# EAGLE design Knob (EAGLE 7.3.0)
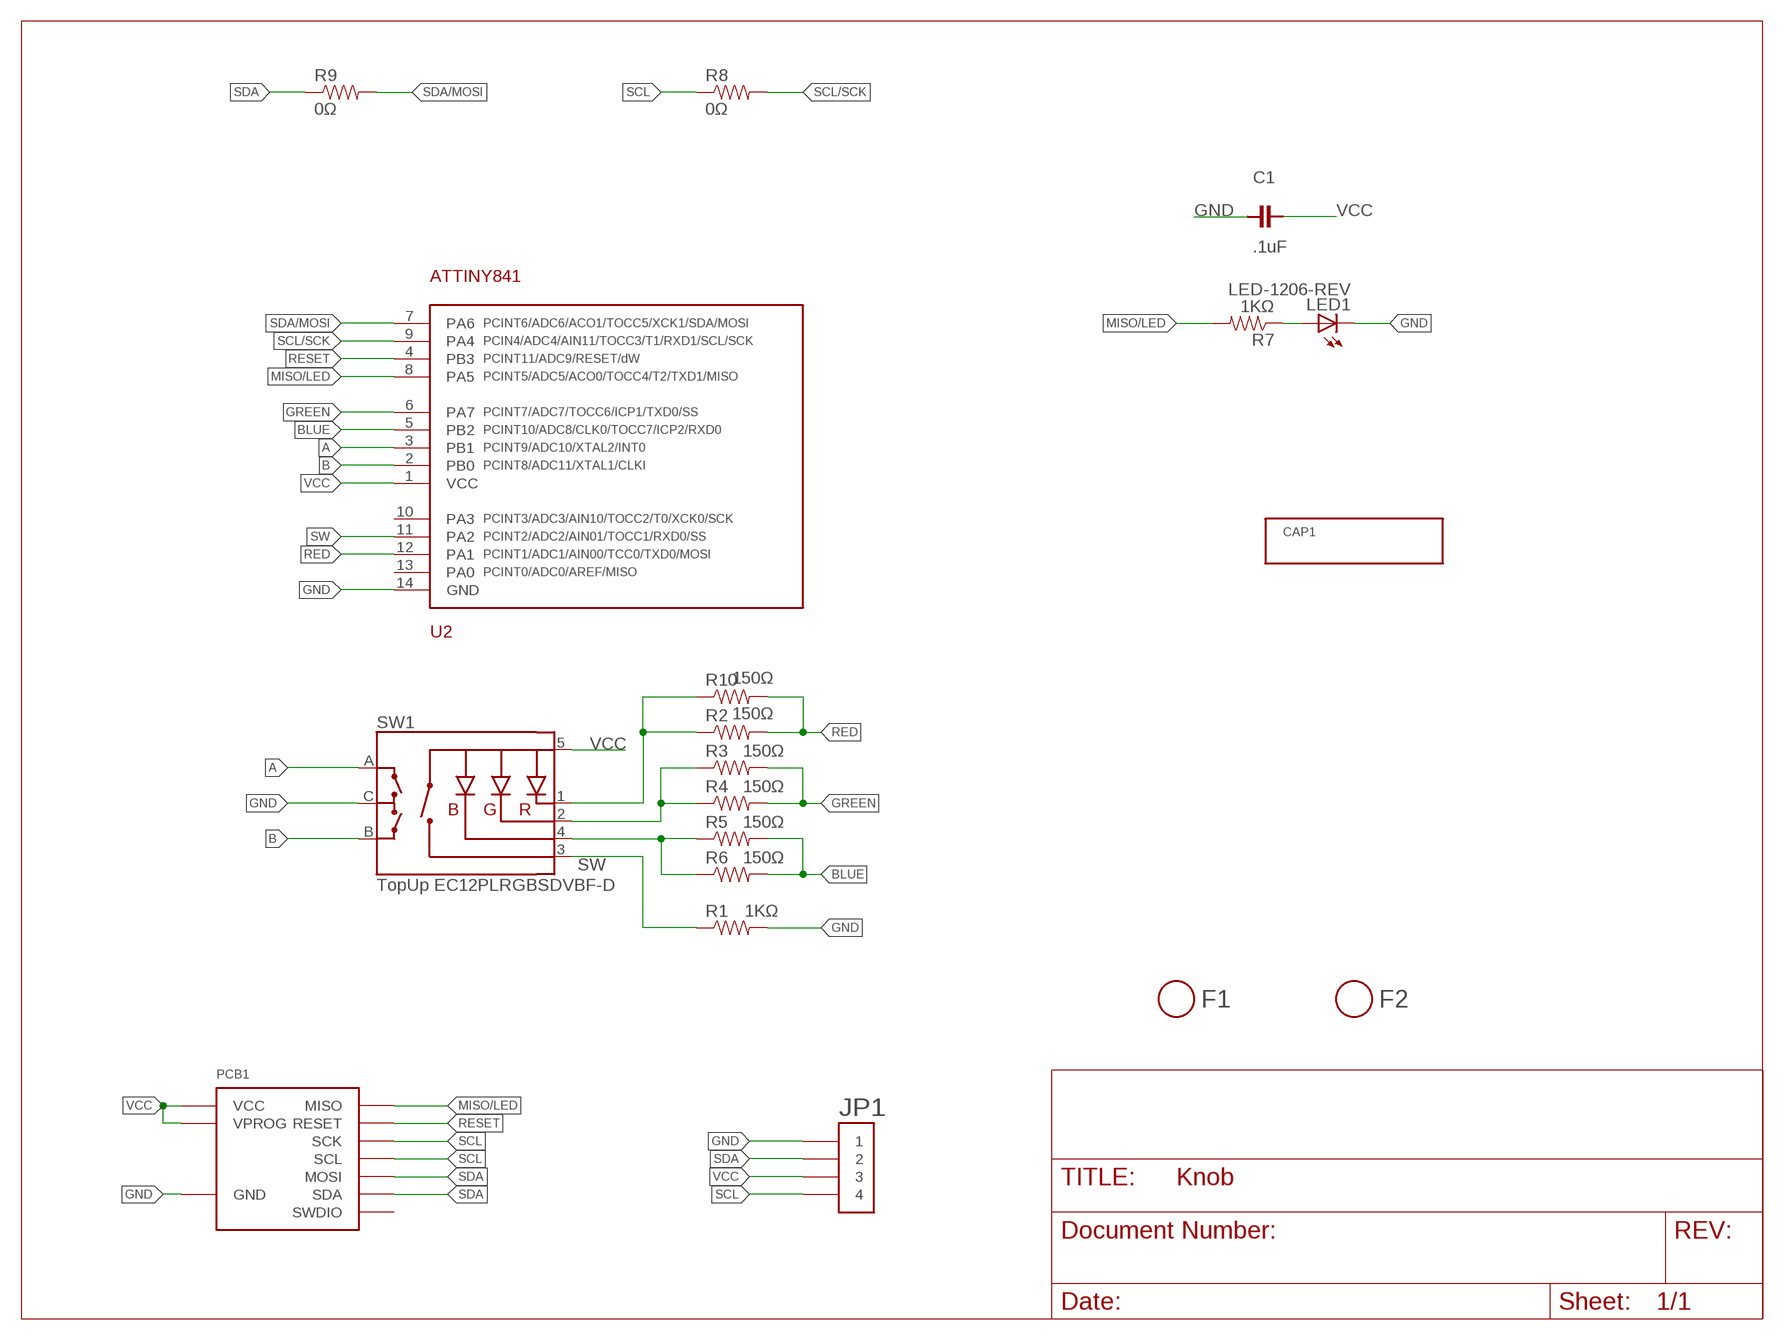
[diagram p0: schematic, sheet 1]
CAP1 (BOM_ITEM): PARTNUM: Knob Cap
FRAME1 (LETTER_L): BOM: EXCLUDE

## Parts
C1  .1uF  CAPACITOR-.1UF  [0603]
F1  FIDUCIAL  [FIDUCIAL_1MM]
F2  FIDUCIAL  [FIDUCIAL_1MM]
JP1  HEADER-1X4-AMPMODU  [AMPMODU-4P]
LED1  LED-1206-REV  [LED-1206-REV]
PCB1  DEVICE-PCB  [DEVICE-PCB]
R1  1KΩ  RESISTOR-1KΩ  [0603]
R2  150Ω  RESISTOR-150Ω  [0603]
R3  150Ω  RESISTOR-150Ω  [0603]
R4  150Ω  RESISTOR-150Ω  [0603]
R5  150Ω  RESISTOR-150Ω  [0603]
R6  150Ω  RESISTOR-150Ω  [0603]
R7  1KΩ  RESISTOR-1KΩ  [0603]
R8  0Ω  RESISTOR-0Ω  [0603]
R9  0Ω  RESISTOR-0Ω  [0603]
R10  150Ω  RESISTOR-150Ω  [0603]
SW1  TopUp EC12PLRGBSDVBF-D  ENCODER_RGB_CASIDEPADS  [ENCODER_LED_3_SIDEPADS]
U2  ATTINY841  [SOIC-14]

## Nets
A: SW1.A U2.3(PB1)
B: SW1.B U2.2(PB0)
BLUE: R5.2 R6.2 U2.5(PB2)
GND: C1.2 JP1.P$1 JP1.P$2 LED1.C PCB1.GND R1.2 SW1.C U2.14(GND)
GREEN: R3.2 R4.2 U2.6(PA7)
MISO/LED: PCB1.MISO R7.2 U2.8(PA5)
N$4: R2.1 R10.1 SW1.1(-R)
N$5: R3.1 R4.1 SW1.2(-G)
N$6: R5.1 R6.1 SW1.4(-B)
N$7: LED1.A R7.1
RED: R2.2 R10.2 U2.12(PA1)
RESET: PCB1.RESET U2.4(PB3)
SCL: JP1.P$7 JP1.P$8 PCB1.CLK(SCK) PCB1.SCL R8.1
SCL/SCK: R8.2 U2.9(PA4)
SDA: JP1.P$3 JP1.P$4 PCB1.MOSI PCB1.SDA R9.1
SDA/MOSI: R9.2 U2.7(PA6)
SW: R1.1 SW1.3(SW) U2.11(PA2)
VCC: C1.1 JP1.P$5 JP1.P$6 PCB1.VCC PCB1.VPROG SW1.5(+) U2.1(VCC)
Unconnected: PCB1.SWDIO U2.10(PA3) U2.13(PA0)

## Library data of the parts
C1 = Modulo:CAPACITOR: Capacitor; PARTNUM: C0603C104K5RACTU
F1 F2 = Modulo:FIDUCIAL; BOM: EXCLUDE
JP1 = Modulo:HEADER-1X4; PARTNUM: 147721-3
LED1 = Modulo:LED: LED; PARTNUM: LTST-C230TBKT
PCB1 = Modulo:DEVICE-PCB: Modulo Footprint; PARTNUM: Knob PCB
R1 R7 = Modulo:RESISTOR: Resistor Basic schematic elements and footprints for 0603, 1206, and PTH resistors.; PARTNUM: ERJ-3EKF1001V
R2-R6 R10 = Modulo:RESISTOR: Resistor Basic schematic elements and footprints for 0603, 1206, and PTH resistors.; PARTNUM: ERJ-3EKF1500V
R8 R9 = Modulo:RESISTOR: Resistor Basic schematic elements and footprints for 0603, 1206, and PTH resistors.; PARTNUM: ERJ-3GEY0R00V
SW1 = Modulo:ENCODER_RGB_CA: Illuminated Rotary Encoder w/ RGB LED and select switch EC12PLRGBSDVBF-D: http://top-up.so-buy.com/front/bin/ptdetail.phtml?Part=EC12PLRGBSDVBF-D; PARTNUM: TopUp EC12PLRGBSDVBF-D
U2 = Modulo:ATTINY841; PARTNUM: ATTINY841-SSUR

## Board
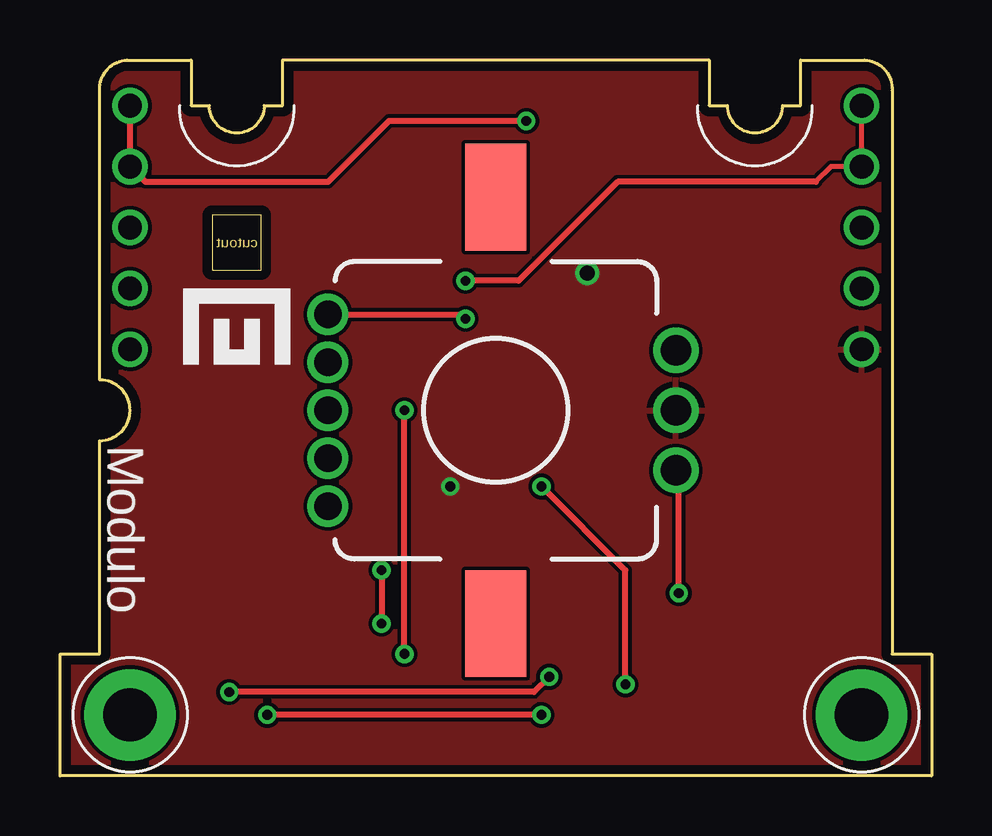
[diagram p1: board, top side]
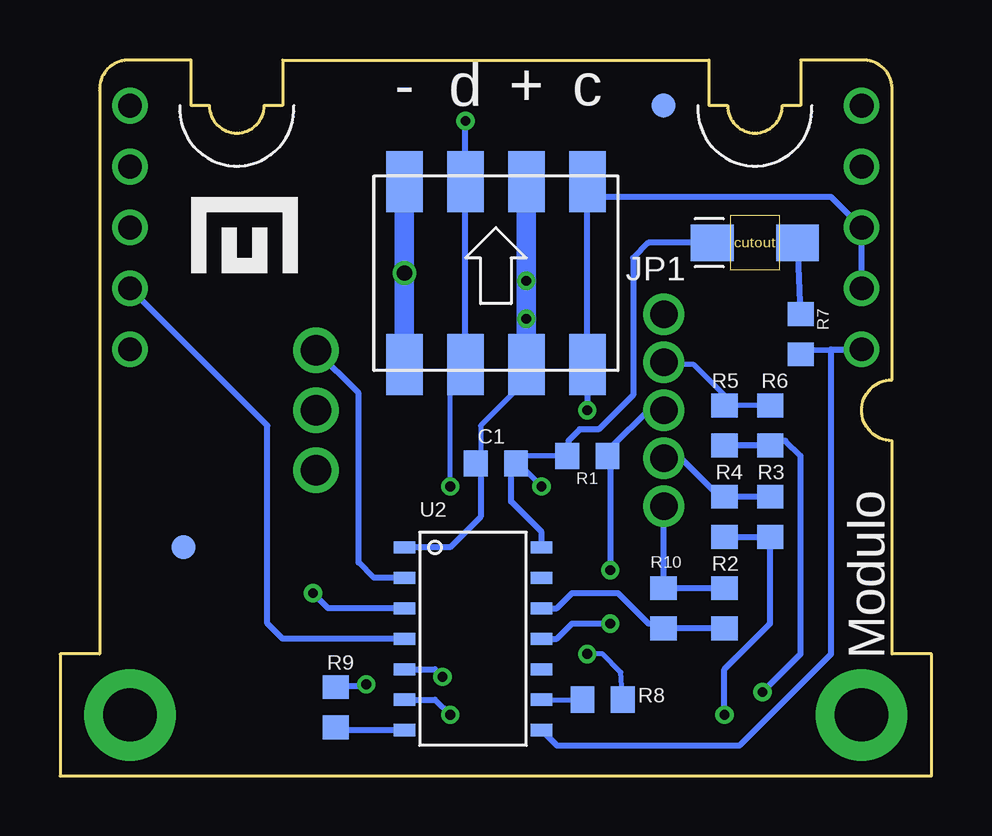
[diagram p2: board, bottom side, seen from below]

Size 36.32 x 29.84 mm. Coordinates in mm from the lower left corner, seen from the top.
Copper layers (1*16): Top 0.0356mm / dielectric 1.5011mm / Bottom 0.0356mm
Design rules "Modulo": minimum track width 6mil, minimum drill 13mil, track to track 6mil, track to pad 6mil, pad to pad 6mil, via to via 6mil, smd to smd 6mil, copper to edge 15mil, drill to drill 6mil, minimum pad ring 7mil, minimum via ring 7mil, stop-mask expansion 3mil, vias tented up to drill 25mil, thermal gap 10mil

### Footprints (pad centres in the part's own frame; a part is rotated, then mirrored left to right if it is on the bottom)
0603 = smd 0.991 x 1.092: 1 -0.838,0; 2 0.838,0
FIDUCIAL_1MM = smd 1 x 1: 1 0,0
AMPMODU-4P = smd 1.524 x 2.54: P$1 -3.81,3.81; P$2 -3.81,-3.81; P$3 -1.27,3.81; P$4 -1.27,-3.81; P$5 1.27,3.81; P$6 1.27,-3.81; P$7 3.81,3.81; P$8 3.81,-3.81
LED-1206-REV = smd 1.778 x 1.524: A -1.778,0; C 1.778,0
DEVICE-PCB = drill 0.991: CLK 2.54,20.32; GND 33.02,17.78; MISO 2.54,17.78; MOSI 2.54,25.4; RESET 33.02,20.32; SCL 2.54,22.86; SDA 2.54,27.94; SWDIO 33.02,22.86; VCC 33.02,25.4; VPROG 33.02,27.94 | drill 2.223 pad 3.81: P$1 2.54,2.54; P$2 33.02,2.54
ENCODER_LED_3_SIDEPADS = drill 1.143: 1 -4,7; 2 -2,7; 3 0,7; 4 2,7; 5 4,7 | drill 1.27: A -2.5,-7.5; B 2.5,-7.5; C 0,-7.5 | smd 4.445 x 2.54: P$1 -8.89,0; P$2 8.89,0
SOIC-14 = smd 0.508 x 0.889: 1 0,-3.175; 2 1.27,-3.175; 3 2.54,-3.175; 4 3.81,-3.175; 5 5.08,-3.175; 6 6.35,-3.175; 7 7.62,-3.175; 8 7.62,2.54; 9 6.35,2.54; 10 5.08,2.54; 11 3.81,2.54; 12 2.54,2.54; 13 1.27,2.54; 14 0,2.54

### Placement (x,y rotation side)
C1  18.16,13.02 0 bottom
F1  31.18,9.53 0 bottom
F2  11.18,27.94 0 bottom
JP1  18.16,20.95 0 bottom
LED1  7.37,22.23 180 bottom
PCB1  0.38,0 0 top
R1  14.35,13.34 180 bottom
R2  8.64,6.99 270 bottom
R3  6.73,10.79 270 bottom
R4  8.64,10.79 270 bottom
R5  8.64,14.61 270 bottom
R6  6.73,14.61 270 bottom
R7  5.46,18.41 270 bottom
R8  13.72,3.17 180 bottom
R9  24.83,2.86 270 bottom
R10  11.18,6.99 270 bottom
SW1  18.16,15.24 90 top
U2  18.8,9.53 270 bottom
U$2  [LOGO-SMALL]  28.96,21.59 0 bottom
U$3  [LOGO-SMALL]  7.05,17.78 0 top

### Tracks (layer width: path | path; a pad name or v marks a point on that pad's centre or on a via)
A  (via drill 0.41)
  Top 0.254: v25.78,7.62 25.78,12.62 SW1.A
  Bottom 0.203: 25.7,12.7 SW1.A
  Bottom 0.254: U2.3 25.15,6.99 v25.78,7.62
B
  Bottom 0.254: SW1.B 23.88,15.96 23.88,8.89 23.24,8.26 U2.2
BLUE  (via drill 0.41)
  Top 0.254: v20.38,4.13 19.75,3.49 v7.05,3.49
  Bottom 0.203: 6.6,13.97 R6.2
  Bottom 0.254: v7.05,3.49 5.46,5.08 5.46,8.89 5.46,13.34 6.1,13.97 6.6,13.97 | U2.5 20.7,4.45 v20.38,4.13 | R6.2 R5.2
GND  (via drill 0.41, 0.64)
  Bottom 0.203: 17.44,13.24 C1.2 17.12,13.34 R1.2 | R1.2 15.08,13.43 | 17.44,13.43 17.44,13.24 | 17.44,13.24 v16.26,12.06 | 15.14,13.65 R1.2
  Bottom 0.254: 21.97,24.13 JP1.P$1 | U2.14 16.26,10.16 17.53,11.43 17.53,12.93 C1.2 | LED1.C 11.81,22.23 12.45,21.59 12.45,15.88 13.88,14.45 14.67,14.45 15.14,13.97 15.14,13.65
  Bottom 0.813: JP1.P$2 v21.97,20.95 21.97,24.13
  pour Top: 35.94,0 35.94,30.48 0.38,30.48 0.38,0
GREEN  (via drill 0.41)
  Top 0.254: v20.07,2.54 v8.64,2.54
  Bottom 0.254: U2.6 20.7,3.17 v20.07,2.54 | v8.64,2.54 8.64,4.45 6.73,6.35 R3.2 R4.2
MISO/LED
  Bottom 0.254: U2.8 15.62,1.27 8,1.27 4.19,5.08 4.19,17.78 PCB1.MISO 5.27,17.75 R7.2
N$4
  Bottom 0.203: 11.18,11.22 SW1.1
  Bottom 0.254: R2.1 R10.1 11.18,11.22
N$5
  Bottom 0.203: R4.1 8.76,11.56
  Bottom 0.254: R3.1 R4.1 | 8.76,11.56 10.54,13.34 11.07,13.34 SW1.2
N$6
  Bottom 0.203: R6.1 R5.1 8.64,15.88 9.91,17.14 11.07,17.14 SW1.4
N$7
  Bottom 0.254: R7.1 LED1.A
RED
  Bottom 0.203: 11.3,6.35 R10.2
  Bottom 0.254: U2.12 15.62,6.99 14.99,7.62 13.08,7.62 11.81,6.35 11.3,6.35 | R2.2 R10.2
RESET
  Bottom 0.254: U2.4 27.05,5.71 27.69,6.35 27.69,14.61 PCB1.RESET
SCL  (via drill 0.41)
  Top 0.254: v14.35,5.08 v14.35,15.24
  Bottom 0.203: R8.1 12.95,4.32 13.72,5.08 v14.35,5.08
  Bottom 0.254: v14.35,15.24 JP1.P$8 14.35,24.13 | 14.35,24.13 JP1.P$7 | 14.35,24.13 4.19,24.13 PCB1.SCL PCB1.CLK
SCL/SCK
  Bottom 0.203: U2.9 R8.2
SDA  (via drill 0.41)
  Top 0.203: PCB1.SDA 2.92,27.3
  Top 0.254: v23.56,3.81 23.56,8.57 v20.07,12.06 | v19.43,27.3 13.72,27.3 11.18,24.77 3.56,24.77 PCB1.MOSI PCB1.SDA
  Bottom 0.203: v20.07,12.06 20.07,17.78 | 19.43,18.41 JP1.P$4 | JP1.P$3 19.43,25.4
  Bottom 0.254: JP1.P$4 JP1.P$3 | 20.07,17.78 19.43,18.41 | R9.1 24.67,3.65 24.58,3.74 23.63,3.74 v23.56,3.81 | 19.43,25.4 v19.43,27.3
SDA/MOSI
  Bottom 0.203: 24.6,1.91 R9.2
  Bottom 0.254: U2.7 24.6,1.91
SW  (via drill 0.41)
  Top 0.254: v13.4,8.57 v13.4,6.35
  Bottom 0.203: R1.1 13.63,13.24 13.4,13.02
  Bottom 0.254: R1.1 13.31,13.74 11.81,15.24 SW1.3 11.18,15.24 | U2.11 15.62,5.71 14.99,6.35 v13.4,6.35 | 13.4,13.02 v13.4,8.57
VCC  (via drill 0.41)
  Top 0.203: 31.5,24.77 32.13,25.4 PCB1.VCC PCB1.VPROG
  Top 0.254: SW1.5 16.7,19.24 v16.89,19.05 | 31.5,24.77 23.24,24.77 19.11,20.64 v16.89,20.64
  Bottom 0.203: JP1.P$6 16.89,16.51 18.8,14.61 18.8,13.11 C1.1
  Bottom 0.254: C1.1 18.8,12.93 18.8,10.79 20.07,9.53 U2.1
  Bottom 0.61: 16.57,18.1 16.89,18.41 JP1.P$6
  Bottom 0.813: JP1.P$6 v16.89,19.05 v16.89,20.64 JP1.P$5